# EAGLE design untitled2 (EAGLE 7.2.0)
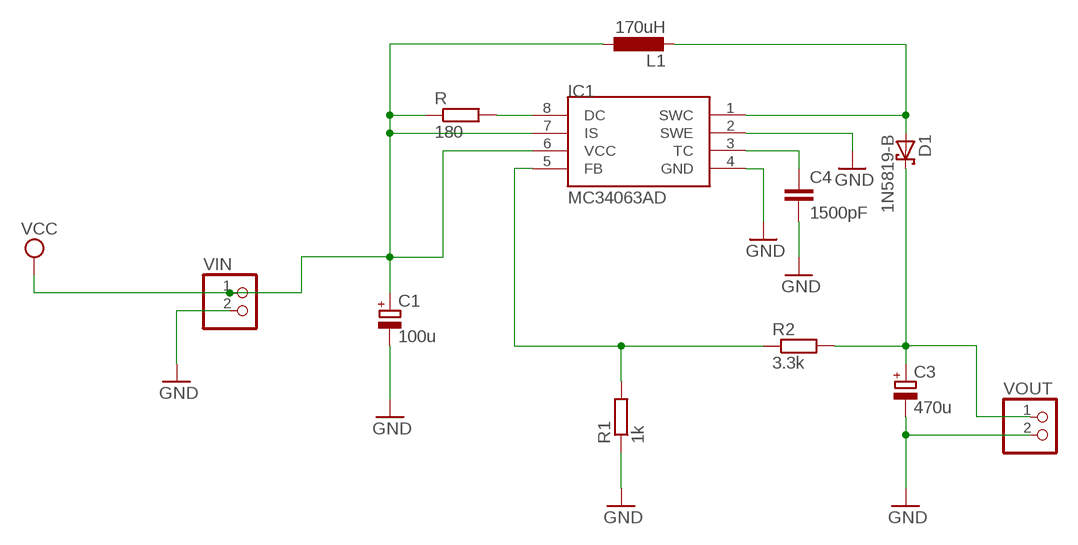
[diagram p0: schematic, sheet 1]

## Parts
C1  100u  CPOL-EUE2,5-6E  [E2,5-6E]
C3  470u  CPOL-EUE5-10.5  [E5-10,5]
C4  1500pF  C-EUC1206  [C1206]
D1  1N5819-B  [DO41-7.6]
IC1  MC34063AD  [SOIC8]
L1  170uH  L-EU0204/5  [0204/5]
R  180  R-EU_R0805W  [R0805W]
R1  1k  R-EU_R1206W  [R1206W]
R2  3.3k  R-EU_R1206W  [R1206W]
VIN  PINHD-1X2  [1X02]
VOUT  PINHD-1X2  [1X02]

## Nets
GND: C1.- C3.- C4.2 IC1.2(SWE) IC1.4(GND) R1.1 VIN.2 VOUT.2
N$1: D1.A IC1.1(SWC) L1.2
N$2: C3.+ D1.C R2.2 VOUT.1
N$3: C4.1 IC1.3(TC)
N$5: IC1.5(FB) R1.2 R2.1
N$8: IC1.8(DC) R.2
VCC: C1.+ IC1.6(VCC) IC1.7(IS) L1.1 R.1 VIN.1

## Library data of the parts
C1 C3 = resistor:CPOL-EU: POLARIZED CAPACITOR, European symbol
C4 = resistor:C-EU: CAPACITOR, European symbol
D1 = diode:1N581*: 1.0A SCHOTTKY BARRIER RECTIFIER Source: http://www.diodes.com/datasheets/ds23001.pdf
IC1 = mc34063:MC34063
L1 = resistor:L-EU: INDUCTOR, European symbol
R R1 R2 = resistor:R-EU_: RESISTOR, European symbol
VIN VOUT = pinhead:PINHD-1X2: PIN HEADER

## Net classes
0 default: width 0.127 mm, drill 0.025 mm, clearance 0.205 mm

## Board
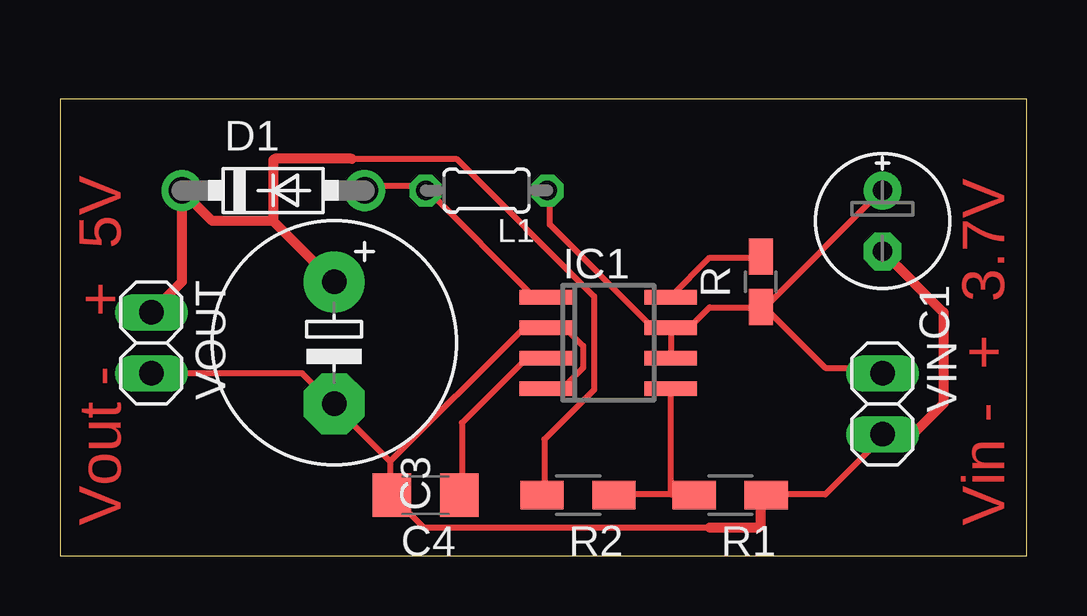
[diagram p1: board, top side]
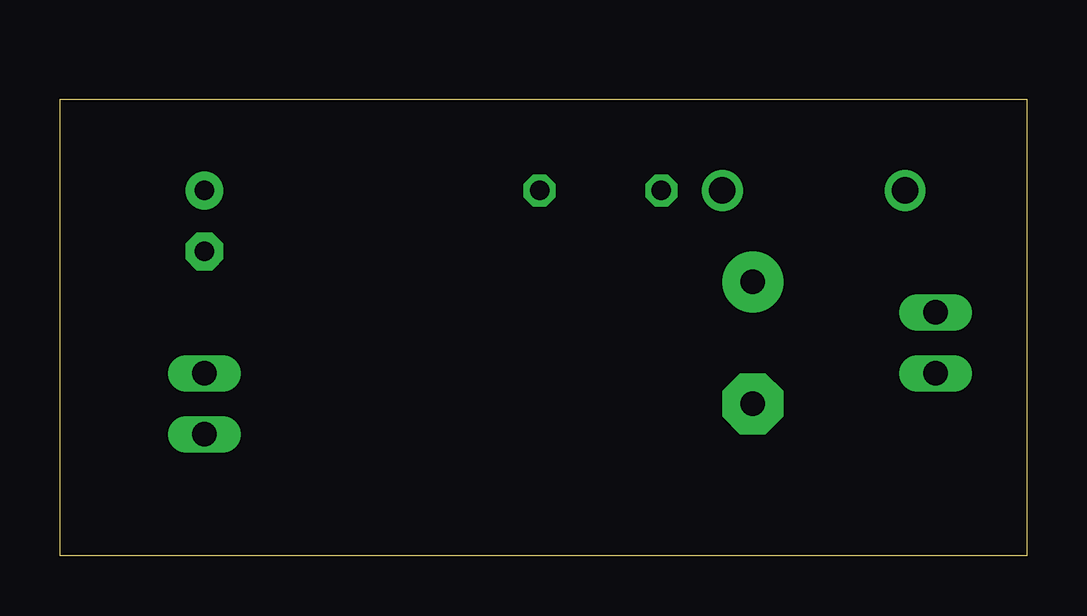
[diagram p2: board, bottom side, seen from below]

Size 40.31 x 19.04 mm. Coordinates in mm from the lower left corner, seen from the top.
Outline: 0,0 40.31,0 40.31,19.04 0,19.04 0,0
Copper layers (1*16): Top 0.035mm / dielectric 1.5mm / Bottom 0.035mm
Design rules "default": minimum track width 10mil, minimum drill 24mil, track to track 8mil, track to pad 8mil, pad to pad 8mil, via to via 8mil, smd to smd 8mil, copper to edge 40mil, drill to drill 8mil, minimum pad ring 10mil, minimum via ring 8mil, stop-mask expansion 4mil, vias tented up to drill 0mil, thermal gap 10mil

### Footprints (pad centres in the part's own frame; a part is rotated, then mirrored left to right if it is on the bottom)
E2,5-6E = drill 0.813 pad 1.575: + -1.27,0 | drill 0.813 pad 1.575 octagon: - 1.27,0
E5-10,5 = drill 1.016 pad 2.54: + -2.54,0 | drill 1.016 pad 2.54 octagon: - 2.54,0
C1206 = smd 1.6 x 1.8: 1 -1.4,0; 2 1.4,0
DO41-7.6 = drill 1.1 pad 1.7: A 3.81,0; C -3.81,0
SOIC8 = smd 0.6 x 2.2: 1 -1.905,-2.6; 2 -0.635,-2.6; 3 0.635,-2.6; 4 1.905,-2.6; 5 1.905,2.6; 6 0.635,2.6; 7 -0.635,2.6; 8 -1.905,2.6
0204/5 = drill 0.813 octagon: 1 -2.54,0; 2 2.54,0
R0805W = smd 1.5 x 1: 1 -1.052,0; 2 1.052,0
R1206W = smd 1.8 x 1.2: 1 -1.499,0; 2 1.499,0
1X02 = drill 1.016 long: 1 -1.27,0; 2 1.27,0

### Placement (x,y rotation side)
C1  34.29,13.97 270 top
C3  11.43,8.89 270 top
C4  15.24,2.54 180 top
D1  8.89,15.24 0 top
IC1  22.86,8.89 270 top
L1  17.78,15.24 180 top
R  29.21,11.43 90 top
R1  27.94,2.54 180 top
R2  21.59,2.54 180 top
VIN  34.29,6.35 270 top
VOUT  3.81,8.89 270 top

### Tracks (layer width: path | path; a pad name or v marks a point on that pad's centre or on a via)
GND  (via drill 0.6)
  Top 0.254: VIN.2 34.2,4.86 31.9,2.57 29.61,2.57 R1.1 29.38,2.34 | IC1.4 20.43,7.16 21.11,7.16 21.8,7.85 21.8,8.77 21.11,9.45 20.43,9.45 IC1.2 20.2,9.45 19.28,9.45 13.77,3.95 | 13.77,3.95 13.77,2.57 C4.2 14,2.34 15.15,1.19 27.08,1.19 | 13.77,3.95 11.47,6.24 C3.- 11.24,6.47 10.1,7.62 3.9,7.62 VOUT.2
  Top 0.406: v34.2,12.67 34.32,12.67 36.83,10.16 36.83,6.35 35.56,5.08 VIN.2 | 27.08,1.19 29.13,1.19 29.21,1.27 29.21,2.31 R1.1
  Bottom 0.254: v34.2,12.67 C1.- | 34.2,5.09 VIN.2
N$1
  Top 0.254: IC1.1 20.2,10.83 19.74,10.83 15.38,15.19 L1.2 15.15,15.42 12.85,15.42 D1.A
N$2
  Top 0.254: 12.16,16.57 16.52,16.57 22.26,10.83 22.26,6.93 20.2,4.86 20.2,2.57 R2.2 | 11.47,11.52 C3.+
  Top 0.406: 12.16,16.57 8.95,16.57 8.89,16.51 8.89,13.97 | 8.89,13.97 C3.+ | 8.89,13.97 6.35,13.97 D1.C 5.08,11.43 VOUT.1
N$3
  Top 0.254: C4.1 16.75,2.57 16.75,5.55 19.28,8.08 20.2,8.08 IC1.3
N$5
  Top 0.254: 25.47,2.57 26.39,2.57 R1.2 | 25.47,2.57 23.18,2.57 R2.1 | 25.47,2.57 25.47,6.93 IC1.5
N$8
  Top 0.254: R.2 29.15,12.44 27.08,12.44 25.47,10.83 IC1.8
VCC
  Top 0.254: IC1.7 25.47,9.68 26.39,9.68 27.08,10.37 29.15,10.37 R.1 29.38,10.37 | IC1.6 25.47,8.31 25.47,9.45 IC1.7 | L1.1 20.43,15.19 20.43,13.82 24.56,9.68 25.25,9.68 IC1.7 | 29.38,10.37 31.9,7.85 34.2,7.85 VIN.1 | 29.38,10.37 34.2,15.19 C1.+

### Text on the board
Top: Vout - + 5V | Vin - + 3.7V